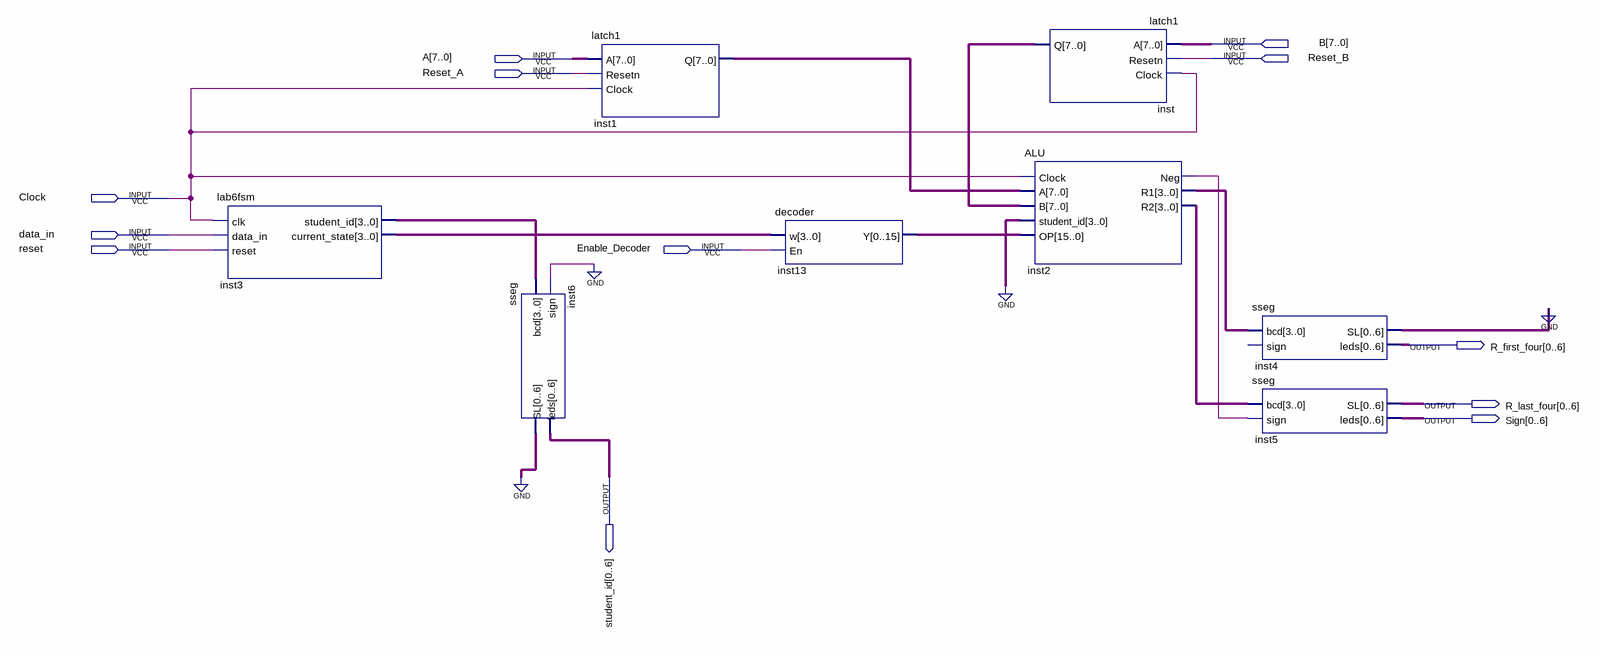
[diagram p0: schematic sheet]
// Quartus schematic finaldesign.bdf as structural Verilog: 8 symbols, 12 pins
module finaldesign (
  input  [7:0] B,
  input  [7:0] A,
  input  Reset_B,
  input  Reset_A,
  input  Clock,
  input  data_in,
  input  reset,
  input  Enable_Decoder,
  output [0:6] R_first_four,
  output [0:6] R_last_four,
  output [0:6] Sign,
  output [0:6] student_id
);

  wire inst2_neg;
  wire [3:0] inst2_r1, inst2_r2, inst3_current_state, inst3_student_id;
  wire [6:0] inst4_sl, inst6_sl;
  wire [7:0] inst1_q, inst_q;
  wire [15:0] inst13_y;

  lab6fsm inst3 (
    .clk(Clock), .data_in(data_in), .reset(reset), .student_id(inst3_student_id),
    .current_state(inst3_current_state));
  sseg inst6 (.bcd(inst3_student_id), .sign(1'b0), .SL(inst6_sl), .leds(student_id));
  latch1 inst1 (.A(A), .Resetn(Reset_A), .Clock(Clock), .Q(inst1_q));
  decoder inst13 (.w(inst3_current_state), .En(Enable_Decoder), .Y(inst13_y));
  latch1 inst (.A(B), .Resetn(Reset_B), .Clock(Clock), .Q(inst_q));
  ALU inst2 (
    .Clock(Clock), .A(inst1_q), .B(inst_q), .student_id(4'b0000), .OP(inst13_y), .Neg(inst2_neg),
    .R1(inst2_r1), .R2(inst2_r2));
  sseg inst4 (.bcd(inst2_r1), .SL(inst4_sl), .leds(R_first_four));  // open: sign
  sseg inst5 (.bcd(inst2_r2), .sign(inst2_neg), .SL(R_last_four), .leds(Sign));
  // also tied to GND on the sheet: {inst4_sl[0], inst4_sl[1], inst4_sl[2], inst4_sl[3], inst4_sl[4], inst4_sl[5], inst4_sl[6], inst6_sl[0], inst6_sl[1], inst6_sl[2], inst6_sl[3], inst6_sl[4], inst6_sl[5], inst6_sl[6]}
endmodule
